# Altium schematic sheet Terra_Spray.SchDoc: Terra Spray
size B; ApprovedBy: Engr. Mohsin Ali; CheckedBy: Engr. Mohsin Ali; Author: Engr. Mohsin Ali; DrawnBy: Engr. Mohsin Ali; Engineer: Engr. Mohsin Ali; Organization: Engr. Mohsin Ali; Address1: PCB Developer; Address2: Pakistan; Address3: +92-346-5311100; Address4: engr.mohsin.ali@hotmail.com; DocumentNumber: 1; Revision: A; SheetNumber: 1; SheetTotal: 1
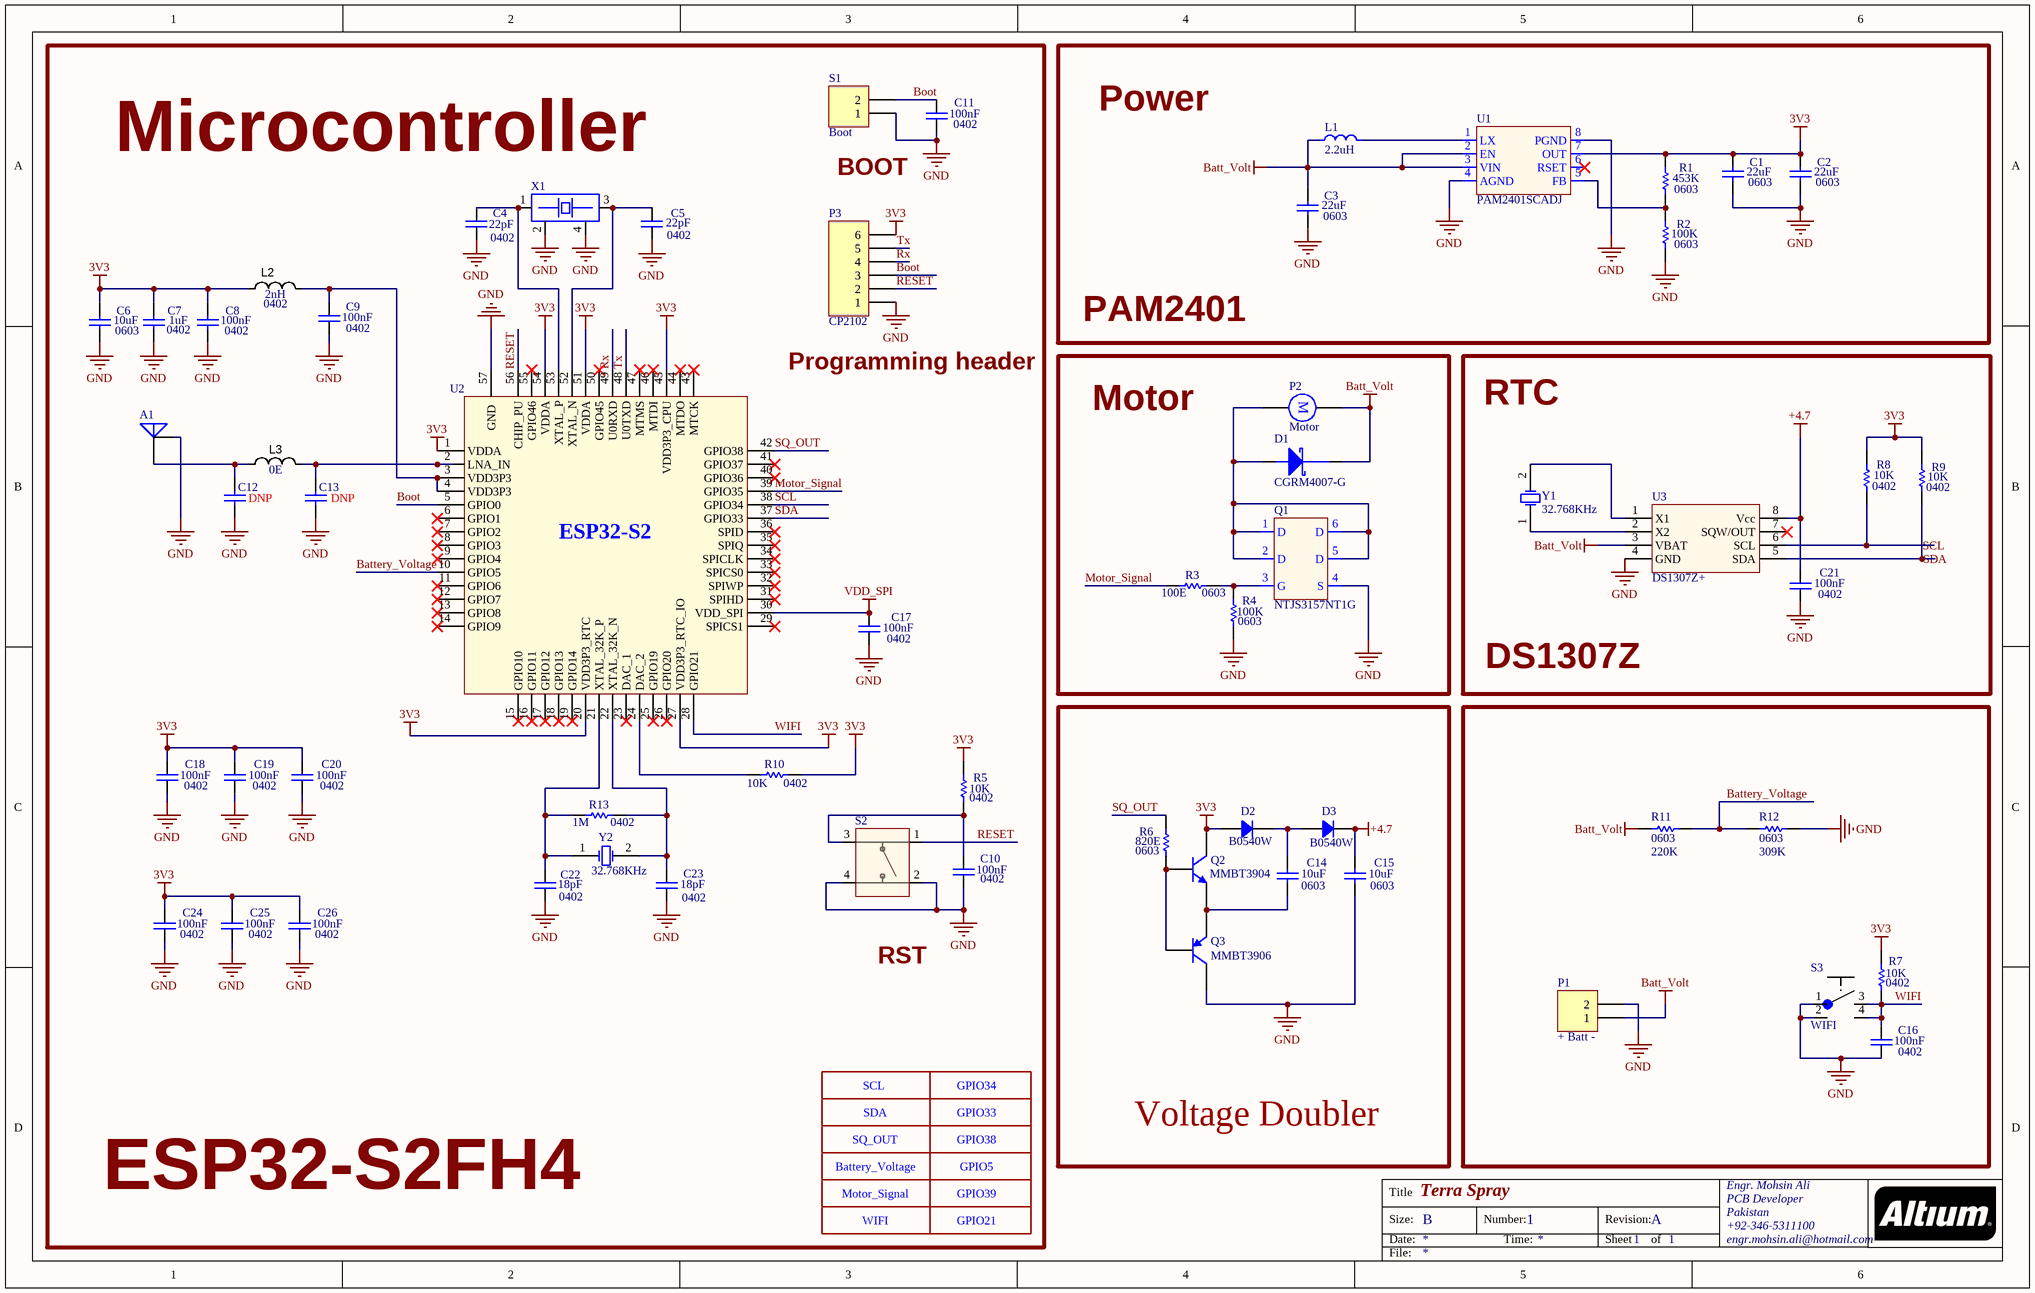
[diagram p0: Terra_Spray.SchDoc]

## Parts
A1  Antenna_1  [ESP32 ANT]  (value not drawn)  (net tie, no BOM)
C1  value 22uF  Case/Package: 0603  [CAPC0603]  (hidden comment: Capacitor)
C2  value 22uF  Case/Package: 0603  [CAPC0603]  (hidden comment: Capacitor)
C3  value 22uF  Case/Package: 0603  [CAPC0603]  (hidden comment: Capacitor)
C4  value 22pF  Case/Package: 0402  [capc0402]  (hidden comment: Cap)
C5  value 22pF  Case/Package: 0402  [capc0402]  (hidden comment: Cap)
C6  value 10uF  Case/Package: 0603  [CAPC0603]  (hidden comment: Capacitor)
C7  value 1uF  Case/Package: 0402  [CAPC0402]  (hidden comment: Capacitor)
C8  value 100nF  Case/Package: 0402  [CAPC0402]  (hidden comment: Cap)
C9  value 100nF  Case/Package: 0402  [CAPC0402]  (hidden comment: Cap)
C10  value 100nF  Case/Package: 0402  [CAPC0402]  (hidden comment: Cap)
C11  value 100nF  Case/Package: 0402  [CAPC0402]  (hidden comment: Cap)
C12  Capacitor  [CAPC0402]  (value not drawn)  (no BOM)
C13  Capacitor  [CAPC0402]  (value not drawn)  (no BOM)
C14  value 10uF  Case/Package: 0603  [CAPC0603]  (hidden comment: Capacitor)
C15  value 10uF  Case/Package: 0603  [CAPC0603]  (hidden comment: Capacitor)
C16  value 100nF  Case/Package: 0402  [CAPC0402]  (hidden comment: Cap)
C17  value 100nF  Case/Package: 0402  [CAPC0402]  (hidden comment: Cap)
C18  value 100nF  Case/Package: 0402  [CAPC0402]  (hidden comment: Cap)
C19  value 100nF  Case/Package: 0402  [CAPC0402]  (hidden comment: Cap)
C20  value 100nF  Case/Package: 0402  [CAPC0402]  (hidden comment: Cap)
C21  value 100nF  Case/Package: 0402  [CAPC0402]  (hidden comment: Cap)
C22  value 18pF  Case/Package: 0402  [capc0402]  (hidden comment: Cap)  (no BOM)
C23  value 18pF  Case/Package: 0402  [capc0402]  (hidden comment: Cap)  (no BOM)
C24  value 100nF  Case/Package: 0402  [CAPC0402]  (hidden comment: Cap)
C25  value 100nF  Case/Package: 0402  [CAPC0402]  (hidden comment: Cap)
C26  value 100nF  Case/Package: 0402  [CAPC0402]  (hidden comment: Cap)
D1  CGRM4007-G  [SOD-123]
D2  B0540W  [SOD123 - duplicate]
D3  B0540W  [SOD123 - duplicate]
L1  value 2.2uH  [INDP5050X20N]  (hidden comment: Inductor)
L2  Case/Package: 0402  Inductance: 2nH  [inductor 0402]  (hidden comment: Inductor)
L3  value 0E  [inductor 0402]  (hidden comment: Inductor)
P1  + Batt -  [2 pin 2.5mm - Header]  (no BOM)
P2  Motor  [2 pin 2.5mm - Header]  (no BOM)
P3  CP2102  [Header 6x1]  (no BOM)
Q1  Mosfet  [SOT-363]  (value not drawn)
Q2  Manufacturer Part Number: MMBT3904  [SOT-23]  (hidden comment: NPN BJT Transistor)
Q3  Manufacturer Part Number: MMBT3906  [SOT-23]  (hidden comment: PNP BJT Transistor)
R1  value 453K  Case/Package: 0603  [RESC0603]  (hidden comment: Resistor)
R2  value 100K  Case/Package: 0603  [RESC0603]  (hidden comment: Resistor)
R3  value 100E  Case/Package: 0603  [RESC0603]  (hidden comment: Resistor)
R4  value 100K  Case/Package: 0603  [RESC0603]  (hidden comment: Resistor)
R5  value 10K  Case/Package: 0402  [RESC0402]  (hidden comment: Resistor)
R6  value 820E  Case/Package: 0603  [RESC0603]  (hidden comment: Resistor)
R7  value 10K  Case/Package: 0402  [RESC0402]  (hidden comment: Resistor)
R8  value 10K  Case/Package: 0402  [RESC0402]  (hidden comment: Resistor)
R9  value 10K  Case/Package: 0402  [RESC0402]  (hidden comment: Resistor)
R10  value 10K  Case/Package: 0402  [RESC0402]  (hidden comment: Resistor)
R11  value 220K  Case/Package: 0603  [RESC0603]  (hidden comment: Resistor)
R12  value 309K  Case/Package: 0603  [RESC0603]  (hidden comment: Resistor)
R13  value 1M  Case/Package: 0402  [RESC0402]  (hidden comment: Resistor)  (no BOM)
S1  Boot  [Switch Replacement]  (no BOM)
S2  Button  [434153017835]  (value not drawn)
S3  WIFI  [FSMJ - SMD - Wifi]
U1  PAM2401SCADJ  [8-TSSOP, 8-MSOP]
U2  ESP32-S2  [QFN56-7x7mm]  (value not drawn)
U3  DS1307Z+  [SOIC-8]
X1  CRYSTAL_1  [Crystal_3225]  (value not drawn)
Y1  32.768KHz  [32.728Khz]
Y2  32.768KHz  [32.728Khz]  (no BOM)

## Blocks framed on the sheet
Motor: D1 P2 Q1 R3 R4
Voltage Doubler: C14 C15 D2 D3 Q2 Q3 R6

## Nets
3V3: C1.2 C2.2 C6.2 C7.2 C8.2 C18.1 C19.1 C20.1 C24.1 C25.1 C26.1 D2.A L2.1 P3.6 Q2.3(C) R1.2 R5.2 R7.2 R8.2 R9.2 R10.1 U1.7(OUT) U2.1(VDDA) U2.20(VDD3P3_RTC) U2.27(VDD3P3_RTC_IO) U2.45(VDD3P3_CPU) U2.51(VDDA) U2.54(VDDA)
+4.7: C15.1 C21.1 D3.K U3.8(Vcc)
Batt_Volt: C3.2 D1.1(Cathode) L1.1 P1.1 P2.1 R11.2 U1.2(EN) U1.3(VIN) U3.3(VBAT)
GND: A1.2(GND) C1.1 C2.1 C3.1 C4.1 C5.1 C6.1 C7.1 C8.1 C9.2 C10.2 C11.1 C12.1 C13.1 C15.2 C16.1 C17.2 C18.2 C19.2 C20.2 C21.2 C22.1 C23.1 C24.2 C25.2 C26.2 P1.2 P3.1 Q1.4(S) Q3.3(C) R2.2 R4.2 R12.1 S1.1 S2.2 S2.4 S3.1 S3.2 U1.4(AGND) U1.8(PGND) U2.57(GND) U3.4(GND) X1.2 X1.4
VDD_SPI: C17.1 U2.30(VDD_SPI)
Battery_Voltage: R11.1 R12.2 U2.10(GPIO5)
Boot: C11.2 P3.3 S1.2 U2.5(GPIO0)
Motor_Signal: R3.2 U2.39(GPIO35)
RESET: P3.2 S2.1 U2.56(CHIP_PU)
Rx: P3.4 U2.49(U0RXD)
SCL: R8.1 U2.38(GPIO34) U3.6(SCL)
SDA: R9.1 U2.37(GPIO33) U3.5(SDA)
SQ_OUT: R6.2 U2.42(GPIO38)
Tx: P3.5 U2.48(U0TXD)
WIFI: C16.2 R7.1 S3.3 S3.4 U2.28(GPIO21)
NetA1_1: A1.1(ANT) C12.2 L3.1
NetC4_2: C4.2 U2.53(XTAL_P) X1.1
NetC5_2: C5.2 U2.52(XTAL_N) X1.3
NetC9_1: C9.1 L2.2 U2.3(VDD3P3) U2.4(VDD3P3)
NetC10_1: C10.1 R5.1 S2.3
NetC13_2: C13.2 L3.2 U2.2(LNA_IN)
NetC14_1: C14.1 D2.K D3.A
NetC14_2: C14.2 Q2.2(E) Q3.2(E)
NetC22_2: C22.2 R13.1 U2.21(XTAL_32K_P) Y2.1(OSC1)
NetC23_2: C23.2 R13.2 U2.22(XTAL_32K_N) Y2.2(OSC2)
NetD1_2: D1.2(Anode) P2.2 Q1.1(D) Q1.2(D) Q1.5(D) Q1.6(D)
NetL1_2: L1.2 U1.1(LX)
NetQ1_3: Q1.3(G) R3.1 R4.1
NetQ2_1: Q2.1(B) Q3.1(B) R6.1
NetR1_1: R1.1 R2.1 U1.5(FB)
NetR10_2: R10.2 U2.24(DAC_2)
NetU3_1: U3.1(X1) Y1.2(OSC2)
NetU3_2: U3.2(X2) Y1.1(OSC1)

Not connected (* = marked no-connect by the designer): U1 6(RSET)*; U2 6(GPIO1)* 7(GPIO2)* 8(GPIO3)* 9(GPIO4)* 11(GPIO6)* 12(GPIO7)* 13(GPIO8)* 14(GPIO9)* 15(GPIO10)* 16(GPIO11)* 17(GPIO12)* 18(GPIO13)* 19(GPIO14)* 23(DAC_1)* 25(GPIO19)* 26(GPIO20)* 29(SPICS1)* 31(SPIHD)* 32(SPIWP)* 33(SPICS0)* 34(SPICLK)* 35(SPIQ)* 36(SPID)* 40(GPIO36)* 41(GPIO37)* 43(MTCK)* 44(MTDO)* 46(MTDI)* 47(MTMS)* 50(GPIO45)* 55(GPIO46)*; U3 7(SQW/OUT)*

## Notes on the sheet
- Microcontroller
- Power
- BOOT
- Programming header
- PAM2401
- RTC
- (near C12) DNP
- (near C13) DNP
- DS1307Z
- RST
- ESP32-S2FH4
- Labels drawn without touching a wire or pin: Battery_Voltage, GPIO5, GPIO21, GPIO33, GPIO34, GPIO38, GPIO39, Motor_Signal, SCL, SDA, SQ_OUT, WIFI
- Title
- Size:
- Date:
- B
- Number:
- Time:
- Revision:
- Sheet
- of
- File:
- (in symbol Motor) M

## Library data of the parts
A1 = Antenna_1: PCB Antenna; Published: 24-Mar-1999; LatestRevisionDate: 17-Jul-2002; LatestRevisionNote: Re-released for DXP Platform.; PackageReference: PIN1; Publisher: Altium Limited
C1-C3 = Capacitor: Ceramic Capacitor,22uF,0603,6.3V; Manufacturer Part Number: *
C4 C5 = Cap: Ceramic Capacitor,22pF,0402,50V; Manufacturer Part Number: *
C6 C14 C15 = Capacitor: Ceramic Capacitor,10uF,0603,10V; Manufacturer Part Number: *
C7 = Capacitor: Ceramic Capacitor,1uF,0402,6.3V; Manufacturer Part Number: *
C8 = Capacitor: Ceramic Capacitor,100nF,0402,6.3V; Manufacturer Part Number: *
C9-C11 C16-C21 C24-C26 = Cap: Ceramic Capacitor,100nF,0402,6.3V
C22 C23 = Cap: Ceramic Capacitor,18pF,0402,50V; Manufacturer Part Number: *
D1 = BAT54HT1G: CGRM4007-G; SMT Diode; 1000V 1A; 2-Pin SOD-123; Manufacturer: Comchip; Max Surge Current: 30A; Max Reverse Current: 5uA; Voltage: 1kV; ComponentLink1URL: http://www.fairchildsemi.com/ds/BA/BAT54HT1G.pdf; ComponentLink1Description: http://www.fairchildsemi.com/ds/BA/BAT54HT1G.pdf; Part No: CGRM4007-G; Supplier 1: Digi-Key; Supplier Part Number 1: 641-1330-1-ND; Manufacturer Part Number: CGRM4007-G; RoHS: Yes; Category: Rectifier Diodes; Stock 1: 1445298; Case/Package: SOD-123-2; Mount: Surface Mount; Package Quantity: 1; Packaging: Tape and Reel; Average Rectified Current: 1A; Current: 1A; Max Reverse Voltage (DC): 1kV; Reverse Voltage: 1kV; RoHS Compliant: Yes; ComponentLink2URL: https://datasheet.ciiva.com/912/cgrm4001-g20thru-20cgrm4007-g20revd-912416.pdf?src-supplier=Digi-Key; ComponentLink2Description: https://datasheet.ciiva.com/912/cgrm4001-g20thru-20cgrm4007-g20revd-912416.pdf?src-supplier=Digi-Key; ComponentLink3URL: https://datasheet.ciiva.com/912/cgrm4001-gthru-cgrm4007-grevd-912417.pdf?src-supplier=Digi-Key; ComponentLink3Description: https://datasheet.ciiva.com/912/cgrm4001-gthru-cgrm4007-grevd-912417.pdf?src-supplier=Digi-Key; ComponentLink4URL: https://datasheet.ciiva.com/912/cgrm4001-gthru-cgrm4007-grevd-912415.pdf?src-supplier=Digi-Key; ComponentLink4Description: https://datasheet.ciiva.com/912/cgrm4001-gthru-cgrm4007-grevd-912415.pdf?src-supplier=Digi-Key
D2 D3 = Diode: Diode Schottky 40V 0.5A 2-Pin SOD-123 T/R; Manufacturer 1: Diodes; Element Configuration: Single; Forward Current: 500mA; Forward Voltage: 620mV; Max Reverse Current: 20uA; Max Forward Surge Current (Ifsm): 5.5A; Max Power Dissipation: 410mW; Manufacturer Part Number: B0540W; Mount: Surface Mount; Number of Pins: 2; Min Operating Temperature: -65°C; Max Operating Temperature: 150°C; Max Repetitive Reverse Voltage (Vrrm): 40V; Average Rectified Current: 500mA; Max Reverse Voltage (DC): 40V; Package Quantity: 3000; Output Current: 500mA; Length: 2.85mm; Height: 1.25mm; Lead Free: Lead Free
L1 = 74404052022: SMD Power Inductors ROHS; Manufacturer Part Number: FNR5012S2R2MT
L2 = Inductor: 2nH ±0.3nH 900mA 120mΩ 0402 Inductors (SMD) RoHS; Manufacturer 1: Murata; Manufacturer Part Number: LQG15HN2N0S02D; Description 1: Fixed Inductors 0402 2.0nH; Category 1: Fixed Inductors; Core Material: Air; DC Resistance (DCR): 120mR; Q Factor: 8; Shielding: Unshielded; Self Resonant Frequency: 6GHz; Test Frequency: 100MHz; Supplier 1: LCSC; Supplier Part Number 1: C97984; RoHS 1: Yes; Stock 1: 84500; Pricing 1: 50=0.00840, 500=0.00620, 1500=0.00580, 5000=0.00540, 25000=0.00520, 50000=0.00520, 50=0.00810, 500=0.00600, 1500=0.00560, 5000=0.00520, 25000=0.00500, 50000=0.00500, 50=0.04180, 500=0.03090, 1500=0.02890, 5000=0.02690, 25000=0.02600, 50000=0.02550, 50=0.03860, 500=0.02850, 1500=0.02670, 5000=0.02480, 25000=0.02400, 50000=0.02360, 50=0.00520, 500=0.00380, 1500=0.00360, 5000=0.00330, 25000=0.00320, 50000=0.00320, 50=0.00480, 500=0.00350, 1500=0.00330, 5000=0.00310, 25000=0.00300, 50000=0.00290, 50=0.04770, 500=0.03530, 1500=0.03300, 5000=0.03070, 25000=0.02970, 50000=0.02920, 50=0.65070, 500=0.48080, 1500=0.44960, 5000=0.41830, 25000=0.40450, 50000=0.39760, 50=0.02550, 500=0.01880, 1500=0.01760, 5000=0.01640, 25000=0.01580, 50000=0.01560, 50=0.46320, 500=0.34230, 1500=0.32010, 5000=0.29780, 25000=0.28800, 50000=0.28310, 50=0.05400, 500=0.03990, 1500=0.03730, 5000=0.03470, 25000=0.03360, 50000=0.03300, 50=0.00840, 500=0.00620, 1500=0.00580, 5000=0.00540, 25000=0.00520, 50000=0.00510, 50=0.00616, 500=0.00455, 1500=0.00426, 5000=0.00396, 25000=0.00383, 50000=0.00376 (AUD); Mount: Surface Mount; Number of Pins: 2; Case Code (Metric): 1005; Case Code (Imperial): 0402; Min Operating Temperature: -55°C; Max Operating Temperature: 125°C; Max DC Current: 900mA; Package Quantity: 10000; Current Rating: 900mA; Packaging: Tape and Reel; Current: 900mA; Termination: SMD/SMT; DC Current: 900mA; Length: 1mm; Height: 0.5mm; Width: 0.02inch; Height - Seated (Max): 0.022inch; Depth: 0.55mm; Radiation Hardening: No; REACH SVHC: No SVHC; Military Standard: Not; ComponentLink1URL: https://datasheet.ciiva.com/11799/0900766b8090d3b8-11799042.pdf?src-supplier=RSComponents; ComponentLink1Description: https://datasheet.ciiva.com/11799/0900766b8090d3b8-11799042.pdf?src-supplier=RSComponents; ComponentLink2URL: https://datasheet.ciiva.com/4976/o05e-4976477.pdf?src-supplier=Mouser; ComponentLink2Description: https://datasheet.ciiva.com/4976/o05e-4976477.pdf?src-supplier=Mouser; ComponentLink3URL: https://datasheet.ciiva.com/8510/l0075s0083lqg15hn-8510907.pdf?src-supplier=Avnet; ComponentLink3Description: https://datasheet.ciiva.com/8510/l0075s0083lqg15hn-8510907.pdf?src-supplier=Avnet; ComponentLink4URL: https://datasheet.ciiva.com/17279/l0075s0083lqg15hn-17279196.pdf?src-supplier=Avnet+Europe; ComponentLink4Description: https://datasheet.ciiva.com/17279/l0075s0083lqg15hn-17279196.pdf?src-supplier=Avnet+Europe
L3 = Inductor: Thick Film Resistor -  0ohm, 1%, 0402; Case/Package: 0402; Manufacturer Part Number: *
P1 S1 = Header 2: Header, 2-Pin; LatestRevisionDate: 17-Jul-2002; LatestRevisionNote: Re-released for DXP Platform.; Publisher: Altium Limited
P2 = Motor: Motor, General Kind; Published: 24-Mar-1999; LatestRevisionDate: 17-Jul-2002; LatestRevisionNote: Re-released for DXP Platform.; PackageReference: RB5-10.5; Publisher: Altium Limited; PackageDescription: Capacitor (Radial); 2 Leads
P3 = Header 6: Header, 6-Pin; LatestRevisionDate: 17-Jul-2002; LatestRevisionNote: Re-released for DXP Platform.; Publisher: Altium Limited
Q1 = NTJS3157NT1G: Trans MOSFET N-CH 20V 3.2A 6-Pin SC-88 T/R; Nominal Vgs: 400mV; Rise Time: 12ns; Rds On Max: 60mR; Input Capacitance: 500pF; Number of Elements: 1; Max Power Dissipation: 1W; Drain to Source Resistance: 70mR; Turn-Off Delay Time: 21ns; On-State Resistance: 45MR; Turn-On Delay Time: 6ns; Fall Time: 11ns; Element Configuration: Single; Gate to Source Voltage (Vgs): 8V; Polarity: N-CHANNEL; Manufacturer Part Number: NTJS3157NT1G; RoHS: Yes; Category: MOSFETs; Pricing 1: 1=0.49000, 10=0.36700, 100=0.22860, 500=0.15644, 1000=0.12034 (USD); Case/Package: SOT-363-6; Number of Pins: 6; Contact Plating: Tin,Matte; Min Operating Temperature: -55°C; Max Operating Temperature: 150°C; Package Quantity: 3000; Packaging: Tape and Reel; Drain to Source Voltage (Vdss): 20V; Continuous Drain Current (ID): 3.2A; Drain to Source Breakdown Voltage: 20V; Power Dissipation: 1W; Voltage Rating (DC): 20V; Current Rating: 3.2A; Series: -; Drain-source On Resistance-Max: 45MR; Length: 2.2mm; Width: 1.35mm; Height: 1mm; Radiation Hardening: No; Lead Free: Lead Free; RoHS Compliant: Yes; ComponentLink1URL: https://datasheet.ciiva.com/956/ntjs3157n-d-956901.pdf?src-supplier=Avnet; ComponentLink1Description: https://datasheet.ciiva.com/956/ntjs3157n-d-956901.pdf?src-supplier=Avnet; ComponentLink2URL: https://datasheet.ciiva.com/4440/ntjs3157n-d-100501-4440501.pdf?src-supplier=Mouser; ComponentLink2Description: https://datasheet.ciiva.com/4440/ntjs3157n-d-100501-4440501.pdf?src-supplier=Mouser; ComponentLink3URL: https://datasheet.ciiva.com/30479/0900766b8120604c-30479918.pdf?src-supplier=RSComponents; ComponentLink3Description: https://datasheet.ciiva.com/30479/0900766b8120604c-30479918.pdf?src-supplier=RSComponents; ComponentLink4URL: https://datasheet.ciiva.com/936/ntjs3157n-d-936857.pdf?src-supplier=Digi-Key; ComponentLink4Description: https://datasheet.ciiva.com/936/ntjs3157n-d-936857.pdf?src-supplier=Digi-Key; ComponentLink5URL: https://datasheet.ciiva.com/936/ntjs3157n-d-936858.pdf?src-supplier=Digi-Key; ComponentLink5Description: https://datasheet.ciiva.com/936/ntjs3157n-d-936858.pdf?src-supplier=Digi-Key; ComponentLink6URL: https://datasheet.ciiva.com/936/ntjs3157n-d-936859.pdf?src-supplier=Digi-Key; ComponentLink6Description: https://datasheet.ciiva.com/936/ntjs3157n-d-936859.pdf?src-supplier=Digi-Key; ComponentLink7URL: https://datasheet.ciiva.com/16396/ntjs3157n-d-16396523.pdf?src-supplier=Future+Electronics; ComponentLink7Description: https://datasheet.ciiva.com/16396/ntjs3157n-d-16396523.pdf?src-supplier=Future+Electronics; ComponentLink8URL: https://datasheet.ciiva.com/11168/ntjs3157n-d-11168397.pdf?src-supplier=Avnet; ComponentLink8Description: https://datasheet.ciiva.com/11168/ntjs3157n-d-11168397.pdf?src-supplier=Avnet
Q2 = NPN BJT Transistor: Bipolar Transistors - BJT SOT-23 NPN; Max Collector Current: 200mA; Max Power Dissipation: 350mW; Max Breakdown Voltage: 40V; Category: BJTs; Mount: Surface Mount; Case/Package: SOT-23; Min Operating Temperature: -55°C; Polarity: NPN; Power Dissipation: 350mW; Current Rating: 200mA; Termination: SMD/SMT; ComponentLink1URL: https://datasheet.ciiva.com/971/mmbt3904-971892.pdf?src-supplier=Digi-Key; ComponentLink1Description: https://datasheet.ciiva.com/971/mmbt3904-971892.pdf?src-supplier=Digi-Key; ComponentLink2URL: https://datasheet.ciiva.com/971/mmbt3904-971893.pdf?src-supplier=Digi-Key; ComponentLink2Description: https://datasheet.ciiva.com/971/mmbt3904-971893.pdf?src-supplier=Digi-Key; ComponentLink3URL: https://datasheet.ciiva.com/22653/1922793-22653482.pdf?src-supplier=Element14; ComponentLink3Description: https://datasheet.ciiva.com/22653/1922793-22653482.pdf?src-supplier=Element14; ComponentLink4URL: https://datasheet.ciiva.com/971/mmbt3904-971891.pdf?src-supplier=Digi-Key; ComponentLink4Description: https://datasheet.ciiva.com/971/mmbt3904-971891.pdf?src-supplier=Digi-Key; ComponentLink5URL: https://datasheet.ciiva.com/26237/mmbt3904-26237242.pdf?src-supplier=Avnet+Europe; ComponentLink5Description: https://datasheet.ciiva.com/26237/mmbt3904-26237242.pdf?src-supplier=Avnet+Europe; ComponentLink6URL: https://datasheet.ciiva.com/7972/2n3904-7972669.pdf?src-supplier=Element14; ComponentLink6Description: https://datasheet.ciiva.com/7972/2n3904-7972669.pdf?src-supplier=Element14; ComponentLink7URL: https://datasheet.ciiva.com/16850/mmbt3904-16850397.pdf?src-supplier=Future+Electronics; ComponentLink7Description: https://datasheet.ciiva.com/16850/mmbt3904-16850397.pdf?src-supplier=Future+Electronics; ComponentLink8URL: https://datasheet.ciiva.com/11201/mmbt3904-11201775.pdf?src-supplier=Avnet; ComponentLink8Description: https://datasheet.ciiva.com/11201/mmbt3904-11201775.pdf?src-supplier=Avnet
Q3 = PNP BJT Transistor: ON SEMICONDUCTOR - MMBT3906LT1G - Bipolar (BJT) Single Transistor, General Purpose, PNP, -40 V, 250 MHz, 225 mW, -200 mA, 300 hFE; Collector Emitter Breakdown Voltage: 40V; Max Power Dissipation: 300mW; Max Collector Current: 200mA; Transition Frequency: 250MHz; Emitter Base Voltage (VEBO): 5V; hFE Min: 60; Collector Emitter Saturation Voltage: -400mV; Voltage Rating (DC): -40V; Current Rating: -200mA; Number of Elements: 1; ComponentLink1Description: Manufacturer Link; ComponentLink1URL: http://www.fairchildsemi.com/; ComponentLink2Description: Datasheet; ComponentLink2URL: http://www.fairchildsemi.com/ds/2N%2F2N3906.pdf; Supplier 1: Digi-Key; Manufacturer: ON Semiconductor; RoHS: Yes; Category: BJTs; Stock 1: 148812; Pricing 1: 1=0.13000, 10=0.09200, 25=0.08800, 100=0.04960, 500=0.03892, 1000=0.02703 (USD); Case/Package: SOT-23-3; Number of Pins: 3; Contact Plating: Tin,Matte; Min Operating Temperature: -55°C; Max Operating Temperature: 150°C; Packaging: Tape and Reel; Polarity: PNP; Collector Emitter Voltage (VCEO): 40V; Collector Base Voltage (VCBO): 40V; Package Quantity: 1; Element Configuration: Single; Gain Bandwidth Product: 250MHz; Max Breakdown Voltage: 40V; Power Dissipation: 300mW; Frequency: 250MHz; Max Frequency: 250MHz; Length: 2.9mm; Width: 1.3mm; Height: 0.94mm; Radiation Hardening: No; Lead Free: Lead Free; REACH SVHC: No SVHC; ComponentLink3URL: https://datasheet.ciiva.com/22664/1708270-22664162.pdf?src-supplier=Element14; ComponentLink3Description: https://datasheet.ciiva.com/22664/1708270-22664162.pdf?src-supplier=Element14; ComponentLink4URL: https://datasheet.ciiva.com/25998/mmbt3906lt1-d-25998821.pdf?src-supplier=Avnet+Europe; ComponentLink4Description: https://datasheet.ciiva.com/25998/mmbt3906lt1-d-25998821.pdf?src-supplier=Avnet+Europe; ComponentLink5URL: https://datasheet.ciiva.com/976/mmbt3906lt1-d-976359.pdf?src-supplier=Digi-Key; ComponentLink5Description: https://datasheet.ciiva.com/976/mmbt3906lt1-d-976359.pdf?src-supplier=Digi-Key; ComponentLink6URL: https://datasheet.ciiva.com/16387/mmbt3906lt1-d-16387191.pdf?src-supplier=Future+Electronics; ComponentLink6Description: https://datasheet.ciiva.com/16387/mmbt3906lt1-d-16387191.pdf?src-supplier=Future+Electronics; ComponentLink7URL: https://datasheet.ciiva.com/976/mmbt3906lt1-d-976360.pdf?src-supplier=Digi-Key; ComponentLink7Description: https://datasheet.ciiva.com/976/mmbt3906lt1-d-976360.pdf?src-supplier=Digi-Key; ComponentLink8URL: https://datasheet.ciiva.com/976/mmbt3906lt1-d-976361.pdf?src-supplier=Digi-Key; ComponentLink8Description: https://datasheet.ciiva.com/976/mmbt3906lt1-d-976361.pdf?src-supplier=Digi-Key; ComponentLink9URL: https://datasheet.ciiva.com/11201/mmbt3906lt1-d-11201803.pdf?src-supplier=Avnet; ComponentLink9Description: https://datasheet.ciiva.com/11201/mmbt3906lt1-d-11201803.pdf?src-supplier=Avnet; ComponentLink10URL: https://datasheet.ciiva.com/4721/mmbt3906lt1-d-4721423.pdf?src-supplier=Mouser; ComponentLink10Description: https://datasheet.ciiva.com/4721/mmbt3906lt1-d-4721423.pdf?src-supplier=Mouser
R1 = Resistor: Thick Film Resistor -  453Kohm, 1%, 0603
R2 R4 = Resistor: Thick Film Resistor -  100Kohm, 1%, 0603
R3 = Resistor: Thick Film Resistor -  100ohm, 1%, 0603
R5 R7-R10 = Resistor: Thick Film Resistor -  10Kohm, 1%, 0402
R6 = Resistor: Thick Film Resistor -  820ohm, 1%, 0603
R11 = Resistor: Thick Film Resistor -  220Kohm, 1%, 0603
R12 = Resistor: Thick Film Resistor -  309Kohm, 1%, 0603
R13 = Resistor: Thick Film Resistor -  1Mohm, 1%, 0402
S2 = 434153017835: 3mm Square Plunger 50mA Top触动 3.5mm SPST 12V SMD Tactile Switches ROHS; Manufacturer Part Number: TS-1809SM-C; ComponentLink1URL: https://datasheet.ciiva.com/52202/434153017835-52202871.pdf?src-supplier=Digi-Key; ComponentLink1Description: https://datasheet.ciiva.com/52202/434153017835-52202871.pdf?src-supplier=Digi-Key
S3 = FSM14J: Pushbutton 6x6mm, Actuator Height off PCB, Vertical 9.50mm; Manufacturer Part Number: MJTP1138BTUBE; MF: TE Connectivity; Package: None; Availability: Unavailable; SnapEDA_Link: https://www.snapeda.com/parts/FSM14J/TE%20Connectivity%20ALCOSWITCH%20Switches/view-part/?ref=snap; MP: FSM14J; Price: None; Value: *; Digi-Key Part Number: MJTP1138BTUBE-ND
U1 = PAM2401SCADJ: IC REG BOOST ADJ 3A SYNC 8MSOP; Manufacturer 1: Diodes; Number of Outputs: 1; Min Input Voltage: 900mV; Max Input Voltage: 4.75V; Min Output Voltage: 2.5V; Max Output Voltage: 5V; Switching Frequency: 1MHz; Synchronous Rectifier: Yes; Output Type: Adjustable; Output Configuration: Positive; Operating Supply Current: 1uA; Supplier 1: Digi-Key; Manufacturer Part Number: PAM2401SCADJ; Stock 1: 42065; Pricing 1: 1=0.99000, 10=0.88500, 25=0.84000, 100=0.64500, 250=0.57000, 500=0.54000, 1000=0.42000 (USD); RoHS: Yes; Mount: Surface Mount; Case/Package: MSOP-8; Number of Pins: 8; Weight: 0.004938oz; Min Operating Temperature: -40°C; Max Operating Temperature: 85°C; Topology: Boost; Packaging: Tape and Reel; Output Current: 3A; Package Quantity: 2500; Min Supply Voltage: 900mV; Lead Free: Lead Free; ComponentLink1URL: http://www.mouser.com/ds/2/115/PAM2401-347378.pdf?src-supplier=Mouser; ComponentLink1Description: http://www.mouser.com/ds/2/115/PAM2401-347378.pdf?src-supplier=Mouser; ComponentLink2URL: https://www.diodes.com/assets/Datasheets/PAM2401.pdf?src-supplier=Digi-Key; ComponentLink2Description: https://www.diodes.com/assets/Datasheets/PAM2401.pdf?src-supplier=Digi-Key; ComponentLink3URL: http://diodes.com/datasheets/PAM2401.pdf?src-supplier=Avnet; ComponentLink3Description: http://diodes.com/datasheets/PAM2401.pdf?src-supplier=Avnet; DigiKey: PAM2401SCADJDICT-ND
U2 = ESP32-S2: WiFi 802.11b/g/n Transceiver Module 2.4GHz; Manufacturer 1: Espressif Systems; Manufacturer Part Number: ESP32-S2FH4; Case/Package: QFN-56
U3 = DS1307Z+: SERIAL TIME CHIP 8PIN, SOIC; Manufacturer 1: Maxim; Time Format: HH:MM:SS; Logic Function: Clock; Operating Supply Voltage: 5V; Memory Size: 56B; Max Supply Voltage: 5.5V; Min Supply Voltage: 4.5V; Interface: I2C,Serial,2-Wire; Date Format: YY-MM-DD; Number of Outputs: 1; Frequency: 32.768kHz; Memory Type: RAM; Operating Supply Current: 1.5mA; Supplier 1: Digi-Key; Manufacturer Part Number: DS1307Z+; Stock 1: 492; Pricing 1: 1=3.82000, 10=3.43200, 25=3.24480, 100=2.81200, 250=2.66780, 500=2.39380, 1000=2.26500 (USD); RoHS: Yes; Mount: Surface Mount; Case/Package: SOIC; Number of Pins: 8; Contact Plating: Tin,Matte; Weight: 0.019048oz; Min Operating Temperature: 0°C; Max Operating Temperature: 70°C; Packaging: Rail/Tube; Package Quantity: 100; Series: DS1307Z; Voltage: 5V; Length: 5mm; Width: 4mm; Height: 1.5mm; Radiation Hardening: No; RoHS Compliant: Yes; Lead Free: Lead Free; REACH SVHC: No SVHC; ComponentLink1URL: https://datasheet.ciiva.com/20167/170004-da-en-01-20167204.pdf?src-supplier=Rapid+Electronics; ComponentLink1Description: https://datasheet.ciiva.com/20167/170004-da-en-01-20167204.pdf?src-supplier=Rapid+Electronics; ComponentLink2URL: https://datasheet.ciiva.com/1491/ds1307-1491905.pdf?src-supplier=Element14; ComponentLink2Description: https://datasheet.ciiva.com/1491/ds1307-1491905.pdf?src-supplier=Element14; ComponentLink3URL: https://datasheet.ciiva.com/1498/ds1307-1498866.pdf?src-supplier=Farnell; ComponentLink3Description: https://datasheet.ciiva.com/1498/ds1307-1498866.pdf?src-supplier=Farnell; ComponentLink4URL: https://datasheet.ciiva.com/1139/46359-1139142.pdf?src-supplier=Element14; ComponentLink4Description: https://datasheet.ciiva.com/1139/46359-1139142.pdf?src-supplier=Element14; ComponentLink5URL: https://datasheet.ciiva.com/14085/ds1307-14085608.pdf?src-supplier=Digi-Key; ComponentLink5Description: https://datasheet.ciiva.com/14085/ds1307-14085608.pdf?src-supplier=Digi-Key; ComponentLink6URL: https://datasheet.ciiva.com/3304/ds1307-3304457.pdf?src-supplier=Avnet; ComponentLink6Description: https://datasheet.ciiva.com/3304/ds1307-3304457.pdf?src-supplier=Avnet; ComponentLink7URL: https://datasheet.ciiva.com/14577/70127931-14577227.pdf?src-supplier=Allied+Electronics; ComponentLink7Description: https://datasheet.ciiva.com/14577/70127931-14577227.pdf?src-supplier=Allied+Electronics; DigiKey: DS1307Z+-ND
X1 = CRYSTAL_1_1: 40MHz ±10ppm 10pF 30Ω SMD-3225 SMD Crystal Resonators RoHS; Manufacturer Part Number: 7M40000049; Case/Package: SMD-3225; Frequency: 40MHz; ComponentLink1URL: https://datasheet.ciiva.com/3852/part27-3852098.pdf?src-supplier=Arrow+Electronics; ComponentLink1Description: https://datasheet.ciiva.com/3852/part27-3852098.pdf?src-supplier=Arrow+Electronics; ComponentLink2URL: https://datasheet.ciiva.com/852/p79e-852307.pdf?src-supplier=Digi-Key; ComponentLink2Description: https://datasheet.ciiva.com/852/p79e-852307.pdf?src-supplier=Digi-Key; ComponentLink3URL: https://datasheet.ciiva.com/852/p79e-852308.pdf?src-supplier=Digi-Key; ComponentLink3Description: https://datasheet.ciiva.com/852/p79e-852308.pdf?src-supplier=Digi-Key; ComponentLink4URL: https://datasheet.ciiva.com/1369/l0445e-1369908.pdf?src-supplier=Farnell; ComponentLink4Description: https://datasheet.ciiva.com/1369/l0445e-1369908.pdf?src-supplier=Farnell; ComponentLink5URL: https://datasheet.ciiva.com/852/p79e-852309.pdf?src-supplier=Digi-Key; ComponentLink5Description: https://datasheet.ciiva.com/852/p79e-852309.pdf?src-supplier=Digi-Key; ComponentLink6URL: https://datasheet.ciiva.com/1361/p79e-1361573.pdf?src-supplier=Element14; ComponentLink6Description: https://datasheet.ciiva.com/1361/p79e-1361573.pdf?src-supplier=Element14; ComponentLink7URL: https://datasheet.ciiva.com/1369/l0445e-1369909.pdf?src-supplier=Farnell; ComponentLink7Description: https://datasheet.ciiva.com/1369/l0445e-1369909.pdf?src-supplier=Farnell; ComponentLink8URL: https://datasheet.ciiva.com/1392/p79e-1392982.pdf?src-supplier=Newark; ComponentLink8Description: https://datasheet.ciiva.com/1392/p79e-1392982.pdf?src-supplier=Newark
Y1 Y2 = XTAL: Crystal Oscillator; P/N: X308032768KGB2SC; Published: 8-Jun-2000; LatestRevisionDate: 17-Jul-2002; LatestRevisionNote: Re-released for DXP Platform.; PackageReference: R38; Publisher: Altium Limited; PackageDescription: Crystal, Thru-Hole; 2 Leads; Body 3.1 x 8.2 mm (Dia.xH)
C12 C13 = Capacitor: Manufacturer Part Number: *; Case/Package: 0402; Value: *